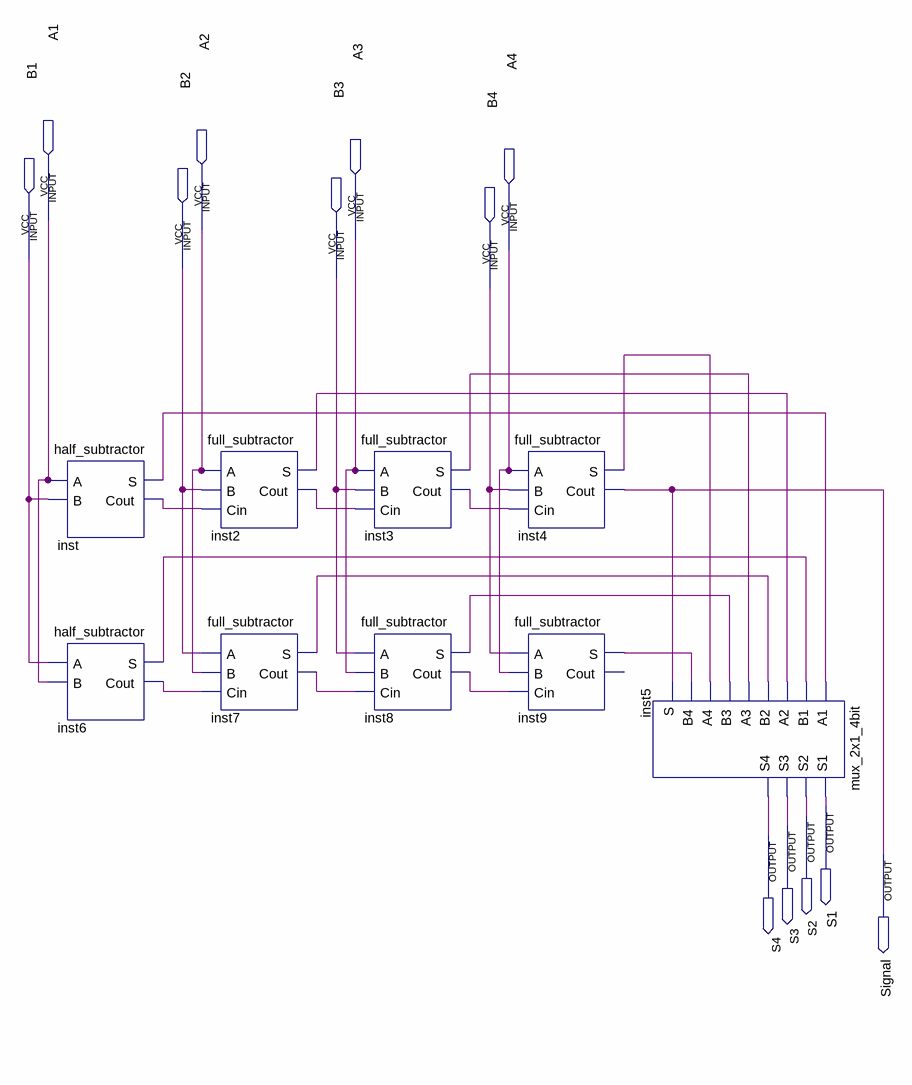
[diagram p0: schematic sheet]
// Quartus schematic 4bit_subtractor.bdf as structural Verilog: 9 symbols, 13 pins
module \4bit_subtractor  (
  input  A1,
  input  A2,
  input  A3,
  input  A4,
  input  B1,
  input  B2,
  input  B3,
  input  B4,
  output S1,
  output S2,
  output S3,
  output S4,
  output Signal
);

  wire inst2_cout, inst2_s, inst3_cout, inst3_s, inst4_s, inst6_cout, inst6_s, inst7_cout, inst7_s,
       inst8_cout, inst8_s, inst9_s, inst_cout, inst_s;

  half_subtractor inst (.A(A1), .B(B1), .S(inst_s), .Cout(inst_cout));
  half_subtractor inst6 (.A(B1), .B(A1), .S(inst6_s), .Cout(inst6_cout));
  full_subtractor inst2 (.A(A2), .B(B2), .Cin(inst_cout), .S(inst2_s), .Cout(inst2_cout));
  full_subtractor inst7 (.A(B2), .B(A2), .Cin(inst6_cout), .S(inst7_s), .Cout(inst7_cout));
  full_subtractor inst3 (.A(A3), .B(B3), .Cin(inst2_cout), .S(inst3_s), .Cout(inst3_cout));
  full_subtractor inst8 (.A(B3), .B(A3), .Cin(inst7_cout), .S(inst8_s), .Cout(inst8_cout));
  full_subtractor inst4 (.A(A4), .B(B4), .Cin(inst3_cout), .S(inst4_s), .Cout(Signal));
  full_subtractor inst9 (.A(B4), .B(A4), .Cin(inst8_cout), .S(inst9_s));  // open: Cout
  mux_2x1_4bit inst5 (
    .A1(inst_s), .B1(inst6_s), .A2(inst2_s), .B2(inst7_s), .A3(inst3_s), .B3(inst8_s), .A4(inst4_s),
    .B4(inst9_s), .S(Signal), .S1(S1), .S2(S2), .S3(S3), .S4(S4));
endmodule
